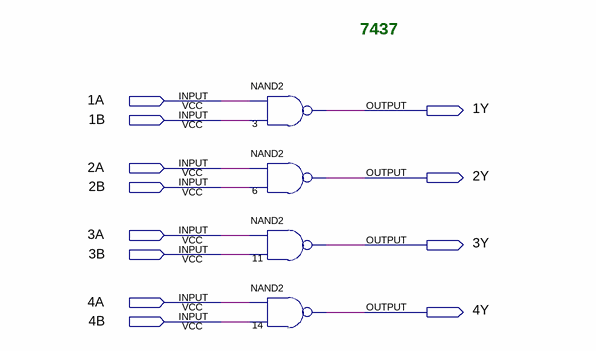
[diagram p0: schematic sheet]
// Quartus schematic 7437.bdf as structural Verilog: 4 symbols, 12 pins
module \7437  (
  input  \1A ,
  input  \1B ,
  input  \2A ,
  input  \2B ,
  input  \3A ,
  input  \3B ,
  input  \4A ,
  input  \4B ,
  output \1Y ,
  output \2Y ,
  output \3Y ,
  output \4Y 
);

  nand u_3 (\1Y , \1A , \1B );
  nand u_6 (\2Y , \2A , \2B );
  nand u_11 (\3Y , \3A , \3B );
  nand u_14 (\4Y , \4A , \4B );

  // Notes on the sheet:
  //   7437
endmodule
